# EAGLE design heliograph (EAGLE 6.5.0)
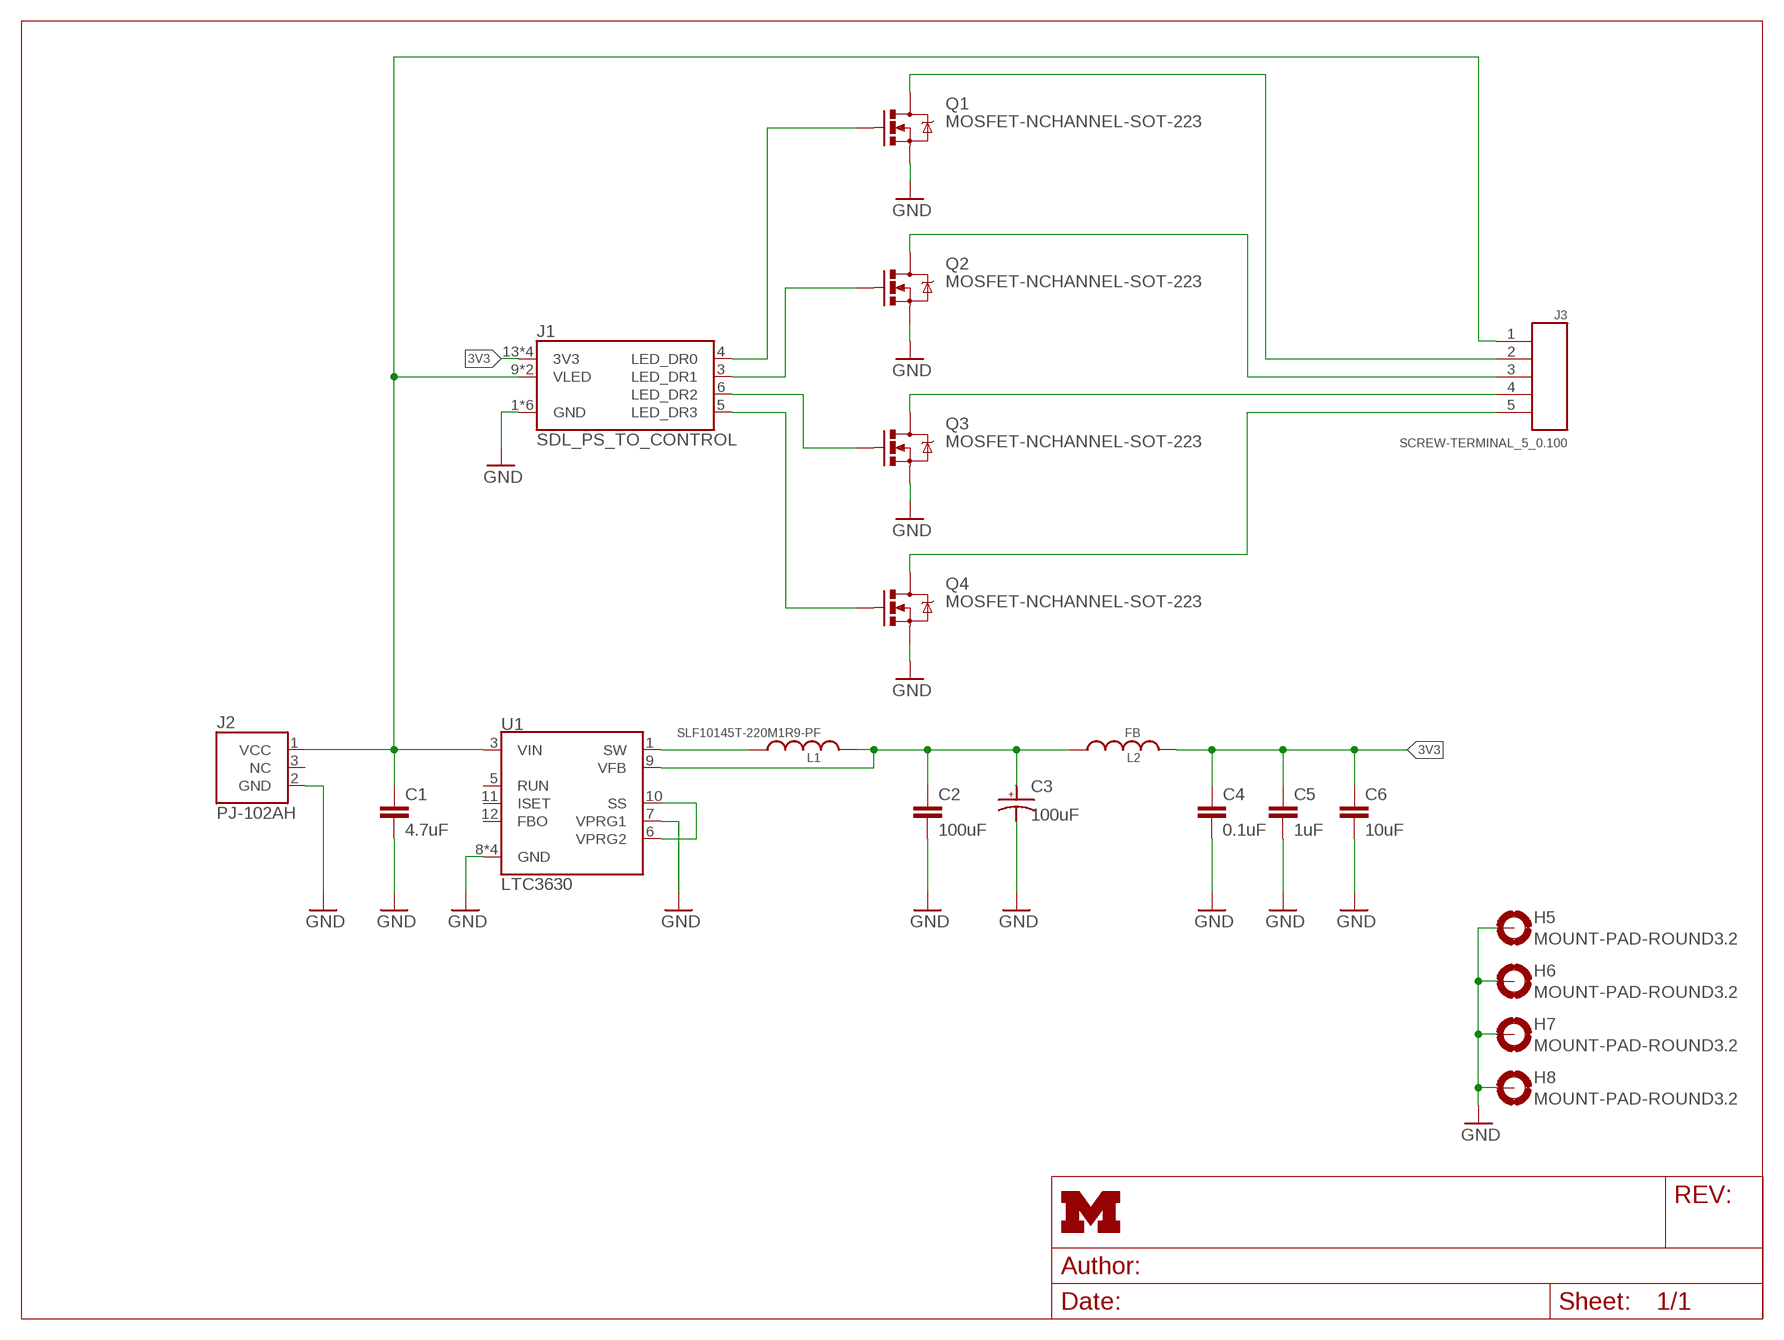
[diagram p0: schematic, sheet 1]
FRAME1 (LETTER_L): HEIGHT: 8.5in; WIDTH: 11in

## Parts
C1  4.7uF  C-EUC2220K  [C2220K]
C2  100uF  C-EUC1210  [C1210]
C3  100uF  CAP_POL2917  [2917-POL]
C4  0.1uF  C-EUC0603  [C0603]
C5  1uF  C-EUC0603  [C0603]
C6  10uF  C-EUC0603  [C0603]
H5  MOUNT-PAD-ROUND3.2  [3,2-PAD]
H6  MOUNT-PAD-ROUND3.2  [3,2-PAD]
H7  MOUNT-PAD-ROUND3.2  [3,2-PAD]
H8  MOUNT-PAD-ROUND3.2  [3,2-PAD]
J1  SDL_PS_TO_CONTROL  [SDL_PS_TO_CONTROL]
J2  PJ-102AH  [PJ-102AH]
J3  SCREW-TERMINAL_5_0.100  [CONN_BLOCK_5]
L1  SLF10145T-220M1R9-PF  [SLF10145]
L2  FB  INDUCTOR0603  [0603_CAP]
Q1  MOSFET-NCHANNEL-SOT-223  [SOT-223]
Q2  MOSFET-NCHANNEL-SOT-223  [SOT-223]
Q3  MOSFET-NCHANNEL-SOT-223  [SOT-223]
Q4  MOSFET-NCHANNEL-SOT-223  [SOT-223]
U1  LTC3630  [MSOP-16(12)]

## Nets
3V3: C4.1 C5.1 C6.1 J1.13(3V3) J1.14(3V3) J1.15(3V3) J1.16(3V3) L2.2
GND: C1.2 C2.2 C3.-(ANODE) C4.2 C5.2 C6.2 H5.B3,2(MOUNT) H6.B3,2(MOUNT) H7.B3,2(MOUNT) H8.B3,2(MOUNT) J1.1(GND) J1.2(GND) J1.7(GND) J1.8(GND) J1.11(GND) J1.12(GND) J2.2(GND) Q1.3(S) Q2.3(S) Q3.3(S) Q4.3(S) U1.7(VPRG1) U1.8(GND) U1.14(GND) U1.16(GND) U1.17(GND)
N$2: L1.1 U1.1(SW)
N$3: C2.1 C3.+(CATHODE) L1.2 L2.1 U1.9(VFB)
N$4: U1.6(VPRG2) U1.10(SS)
N$5: J1.4(LED_DR0) Q1.1(G)
N$6: J1.3(LED_DR1) Q2.1(G)
N$7: J1.6(LED_DR2) Q3.1(G)
N$8: J1.5(LED_DR3) Q4.1(G)
N$9: J3.3 Q2.2(D) Q2.4(D)
N$10: J3.2 Q1.2(D) Q1.4(D)
N$11: J3.5 Q4.2(D) Q4.4(D)
N$12: J3.4 Q3.2(D) Q3.4(D)
VIN: C1.1 J1.9(VLED) J1.10(VLED) J2.1(VCC) J3.1 U1.3(VIN)
Unconnected: J2.3(NC) U1.5(RUN) U1.11(ISET) U1.12(FBO)

## Library data of the parts
C1 = rcl:C-EU: CAPACITOR, European symbol; DIGIKEY: 445-1450-1-ND
C2 = rcl:C-EU: CAPACITOR, European symbol; DIGIKEY: 1276-3364-1-ND
C3 = passives:CAP_POL; DIGIKEY: 399-3769-1-ND
C4 = rcl:C-EU: CAPACITOR, European symbol; DIGIKEY: 445-1316-1-ND
C5 = rcl:C-EU: CAPACITOR, European symbol; DIGIKEY: 445-1604-1-ND
C6 = rcl:C-EU: CAPACITOR, European symbol; DIGIKEY: 445-9065-1-ND
H5-H8 = holes:MOUNT-PAD-ROUND: MOUNTING PAD, round
J1 = sdl:SDL_PS_TO_CONTROL
J2 = connector:PJ-102AH: DC Power Jack 2.0mm / 5.5mm; DIGIKEY: CP-102AH-ND
J3 = headers:SCREW-TERMINAL_5_0.100: 5x 0.100 in screw terminal block; DIGIKEY: 277-1276-ND
L1 = passives:SLF10145: Fixed inductor 1.9 A; DIGIKEY: 445-1981-1-ND
L2 = passives:INDUCTOR; DIGIKEY: 490-1011-1-ND
Q1-Q4 = fets:MOSFET-NCHANNEL: Generic NMOS footprint; DIGIKEY: 568-9714-1-ND
U1 = chips:LTC3630: 65 V 500 mA Step Down converter; DIGIKEY: LTC3630EMSE#PBF-ND

## Board
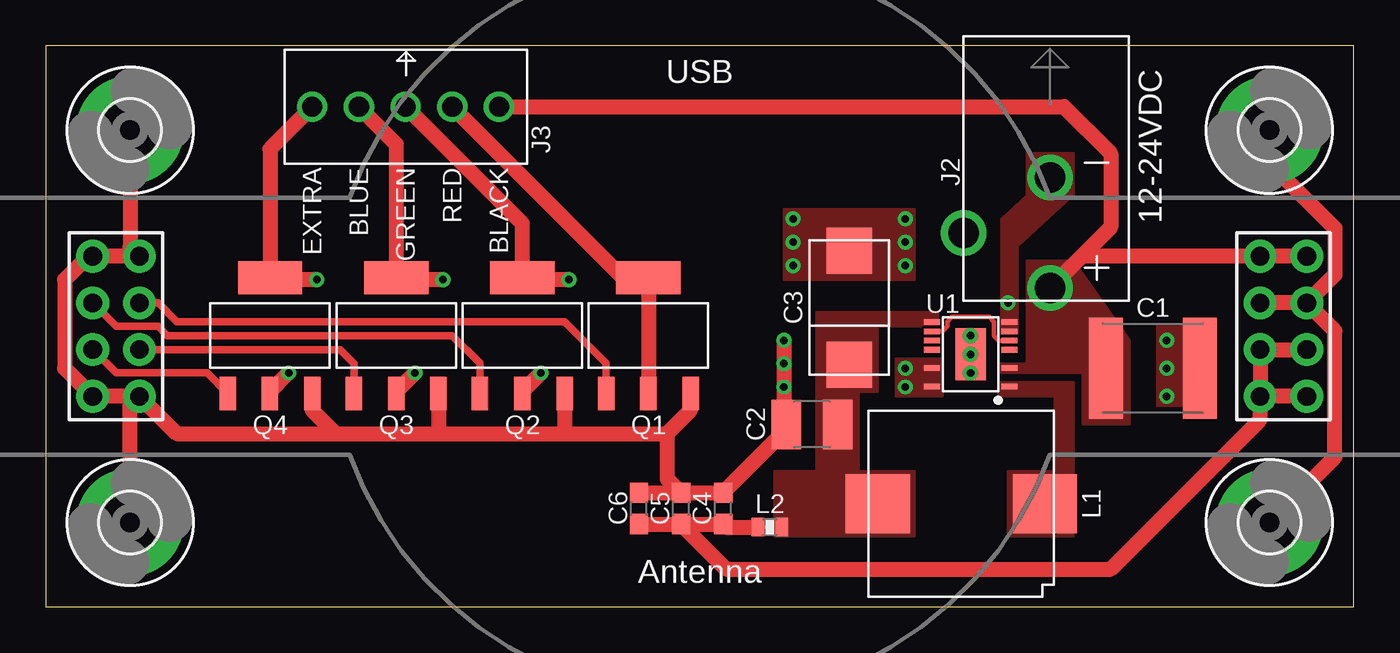
[diagram p1: board, top side]
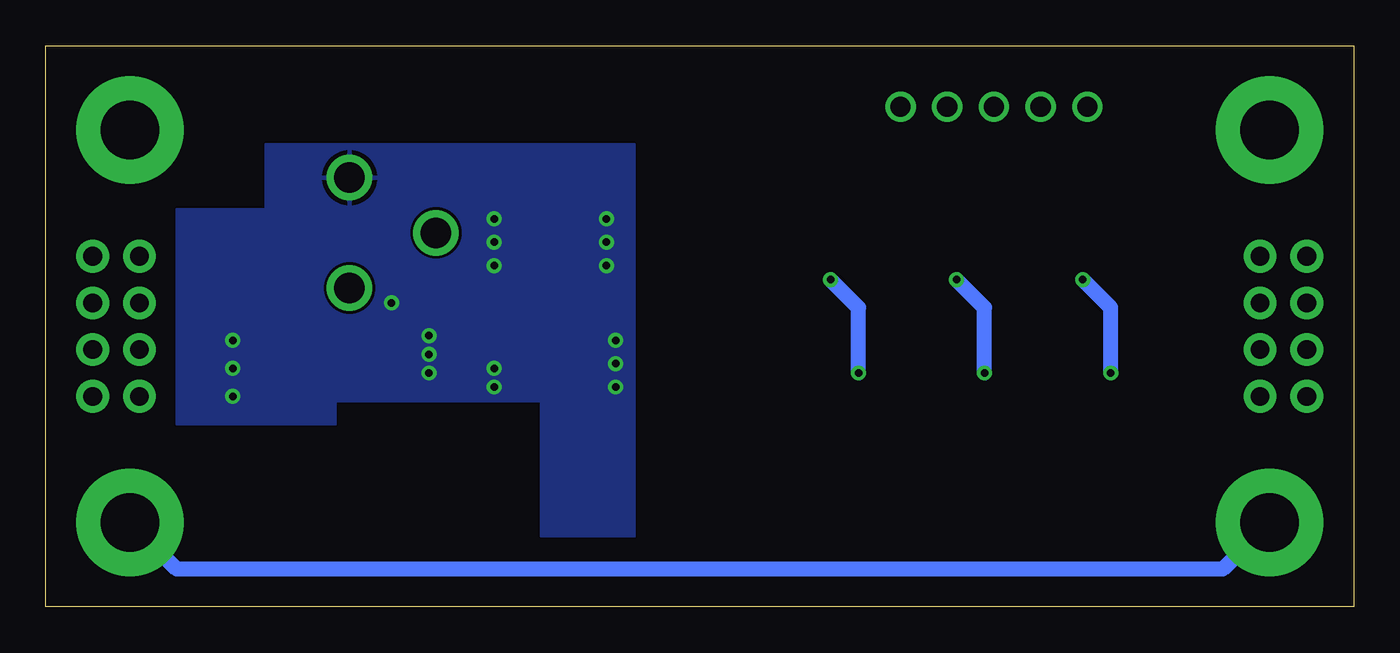
[diagram p2: board, bottom side, seen from below]

Size 71.12 x 30.48 mm. Coordinates in mm from the lower left corner, seen from the top.
Outline: 0,0 71.12,0 71.12,30.48 0,30.48 0,0
Copper layers (1*16): Top 0.0178mm / dielectric 59mil / Bottom 0.0178mm
Design rules "sunstone-2lyr_v1.0.0.3": minimum track width 6mil, minimum drill 14mil, track to track 6mil, track to pad 6mil, pad to pad 6mil, via to via 6mil, smd to smd 6mil, copper to edge 20mil, drill to drill 16mil, minimum pad ring 8mil, minimum via ring 8mil, stop-mask expansion 3mil, vias tented up to drill 0mil, thermal gap 10mil

### Footprints (pad centres in the part's own frame; a part is rotated, then mirrored left to right if it is on the bottom)
C2220K = smd 1.85 x 5.5: 1 -2.55,0; 2 2.55,0
C1210 = smd 1.6 x 2.7: 1 -1.4,0; 2 1.4,0
2917-POL = smd 2.48 x 2.5: + 0,3.1; - 0,-3.1
C0603 = smd 1.1 x 1: 1 -0.85,0; 2 0.85,0
3,2-PAD = drill 3.2 pad 5.842: B3,2 0,0
SDL_PS_TO_CONTROL = drill 1.016 pad 1.778: 1 -33.02,3.81; 2 -30.48,3.81; 3 -33.02,1.27; 4 -30.48,1.27; 5 -33.02,-1.27; 6 -30.48,-1.27; 7 -33.02,-3.81; 8 -30.48,-3.81; 9 30.48,3.81; 10 33.02,3.81; 11 30.48,1.27; 12 33.02,1.27; 13 30.48,-1.27; 14 33.02,-1.27; 15 30.48,-3.81; 16 33.02,-3.81
PJ-102AH = drill 1.65: 1 0,-3; 2 0,3; 3 -4.7,0
CONN_BLOCK_5 = drill 1.1: 1 -5.08,0; 2 -2.54,0; 3 0,0; 4 2.54,0; 5 5.08,0
SLF10145 = smd 3.5 x 3.2: 1 -4.55,0; 2 4.55,0
0603_CAP = smd 0.7 x 1: 1 -0.65,0; 2 0.65,0
SOT-223 = smd 0.9 x 1.8: 1 -2.3,-3.15; 2 0,-3.15; 3 2.3,-3.15 | smd 3.5 x 1.8: 4 0,3.15
MSOP-16(12) = smd 0.305 x 0.889: 1 -1.75,-2.106; 3 -0.75,-2.106; 5 0.25,-2.106; 6 0.75,-2.106; 7 1.25,-2.106; 8 1.75,-2.106; 9 1.75,2.106; 10 1.25,2.106; 11 0.75,2.106; 12 0.25,2.106; 14 -0.75,2.106; 16 -1.75,2.106 | smd 2.845 x 1.651: 17 0,0

### Placement (x,y rotation side)
C1  60.2,12.95 0 top
C2  41.66,9.91 180 top
C3  43.69,16.26 180 top
C4  36.83,5.33 90 top
C5  34.54,5.33 90 top
C6  32.26,5.33 90 top
H5  4.57,4.57 0 top
H6  4.57,25.91 0 top
H7  66.55,25.91 0 top
H8  66.55,4.57 0 top
J1  35.56,15.24 0 top
J2  54.61,20.32 0 top
J3  19.56,27.18 180 top
L1  49.78,5.59 180 top
L2  39.37,4.32 180 top
Q1  32.77,14.73 0 top
Q2  25.91,14.73 0 top
Q3  19.05,14.73 0 top
Q4  12.19,14.73 0 top
U1  50.29,13.72 90 top

### Tracks (layer width: path | path; a pad name or v marks a point on that pad's centre or on a via)
3V3
  Top 0.813: C6.1 C5.1 | C5.1 C4.1 37,4.32 L2.2 | C5.1 37,2.03 57.91,2.03 66.04,10.16 J1.15 | J1.15 J1.13 J1.14 | J1.16 J1.15
GND  (via drill 0.41)
  Top 0.813: Q4.3 14.49,10.65 15.75,9.4 | 15.75,9.4 21.59,9.4 | 21.59,9.4 28.19,9.4 | 28.19,9.4 33.78,9.4 | 33.78,9.4 35.05,10.67 35.05,11.57 Q1.3 | Q3.3 21.35,9.64 21.59,9.4 | Q2.3 28.21,9.41 28.19,9.4 | J1.8 J1.7 1.02,12.95 1.02,17.78 2.29,19.05 J1.1 J1.2 4.57,19.56 H6.B3,2 | J1.8 7.11,9.4 15.75,9.4 | C6.2 C5.2 | C5.2 C4.2 40.26,9.61 C2.2 40.13,10.03 v40.13,11.94 v40.13,13.21 v40.13,14.48 | J1.12 J1.11 | H5.B3,2 4.57,10.92 J1.8 | H7.B3,2 66.55,24.13 70.1,20.57 70.1,18.03 J1.12 | H8.B3,2 70.1,8.13 70.1,14.99 J1.12 | 33.78,9.4 33.78,6.95 C5.2
  Bottom 0.813: H5.B3,2 7.11,2.03 64.01,2.03 H8.B3,2
  other vias: 46.74,12.95 50.29,14.73 50.29,13.72 50.29,12.7 52.32,16.51 46.74,11.94 46.74,18.54 46.74,19.81 46.74,21.08 60.96,14.48 60.96,12.95 60.96,11.43 40.64,21.08 40.64,19.81 40.64,18.54
  pour Top (no thermals): 55.88,24.64 55.88,22.35 52.83,19.56 52.83,14.86 51.97,14.86 51.97,21.08 53.34,22.35 53.34,24.64
  pour Top (no thermals): 46.23,13.46 46.23,11.43 48.77,11.43 48.77,13.46
  pour Bottom: 64.01,9.91 64.01,21.59 59.18,21.59 59.18,25.15 39.12,25.15 39.12,3.81 44.2,3.81 44.2,11.18 55.37,11.18 55.37,9.91
  pour Top (no thermals): 60.45,15.24 60.45,10.92 63.5,10.92 63.5,15.24
  pour Top (no thermals): 40.13,21.59 47.24,21.59 47.24,17.78 40.13,17.78
N$2
  pour Top (no thermals): 51.82,12.19 51.82,11.43 54.86,11.43 54.86,7.37 52.32,7.37 52.32,3.81 55.88,3.81 55.88,12.19
N$3
  pour Top (no thermals): 47.24,3.81 39.62,3.81 39.62,7.37 41.91,7.37 41.91,16 48.51,16 48.51,15.24 45.21,15.24 45.21,11.68 44.2,11.68 44.2,7.37 47.24,7.37
N$4
  Top 0.254: U1.6 51.83,14.47 51.56,14.73 51.56,15.49 51.31,15.75 49.28,15.75 49.02,15.49 49.02,15.24 48.75,14.97 U1.10
N$5
  Top 0.406: J1.4 6.1,16.51 7.11,15.49 28.19,15.49 30.47,13.22 Q1.1
N$6
  Top 0.406: J1.3 3.81,15.24 6.1,15.24 6.6,14.73 22.1,14.73 23.61,13.22 Q2.1 23.62,11.6
N$7
  Top 0.406: J1.6 16,13.97 16.76,13.21 16.76,11.6 Q3.1
N$8
  Top 0.406: J1.5 3.81,12.7 8.77,12.7 Q4.1
N$9  (via drill 0.41)
  Top 0.813: J3.3 25.91,20.83 Q2.4 26.01,17.78 v28.45,17.78 | Q2.2 25.91,11.68 v26.92,12.7
  Bottom 0.813: v26.92,12.7 26.92,16.26 v28.45,17.78
N$10
  Top 0.813: J3.2 31.39,17.88 Q1.4 Q1.2
N$11  (via drill 0.41)
  Top 0.813: J3.5 12.19,24.89 Q4.4 12.29,17.78 v14.73,17.78 | Q4.2 12.19,11.68 v13.21,12.7
  Bottom 0.813: v13.21,12.7 13.21,16.26 v14.73,17.78
N$12  (via drill 0.41)
  Top 0.813: J3.4 19.05,25.15 Q3.4 19.15,17.78 v21.59,17.78 | Q3.2 19.05,11.68 v20.07,12.7
  Bottom 0.813: v20.07,12.7 20.07,16.26 v21.59,17.78
VIN
  Top 0.813: 56.34,19.05 J1.9 J1.10 | 56.34,19.05 J2.1 | J3.1 55.37,27.18 57.91,24.64 57.91,20.62 56.34,19.05
  pour Top (no thermals): 53.34,18.8 55.88,18.8 58.93,14.48 58.93,9.91 56.39,9.91 56.39,12.7 51.82,12.7 51.82,13.21 53.34,13.21

### Text on the board
tPlace: 12-24VDC | USB | EXTRA | BLUE | GREEN | RED | BLACK | Antenna